# EAGLE design DigitalClockSegment (EAGLE 9.6.1)
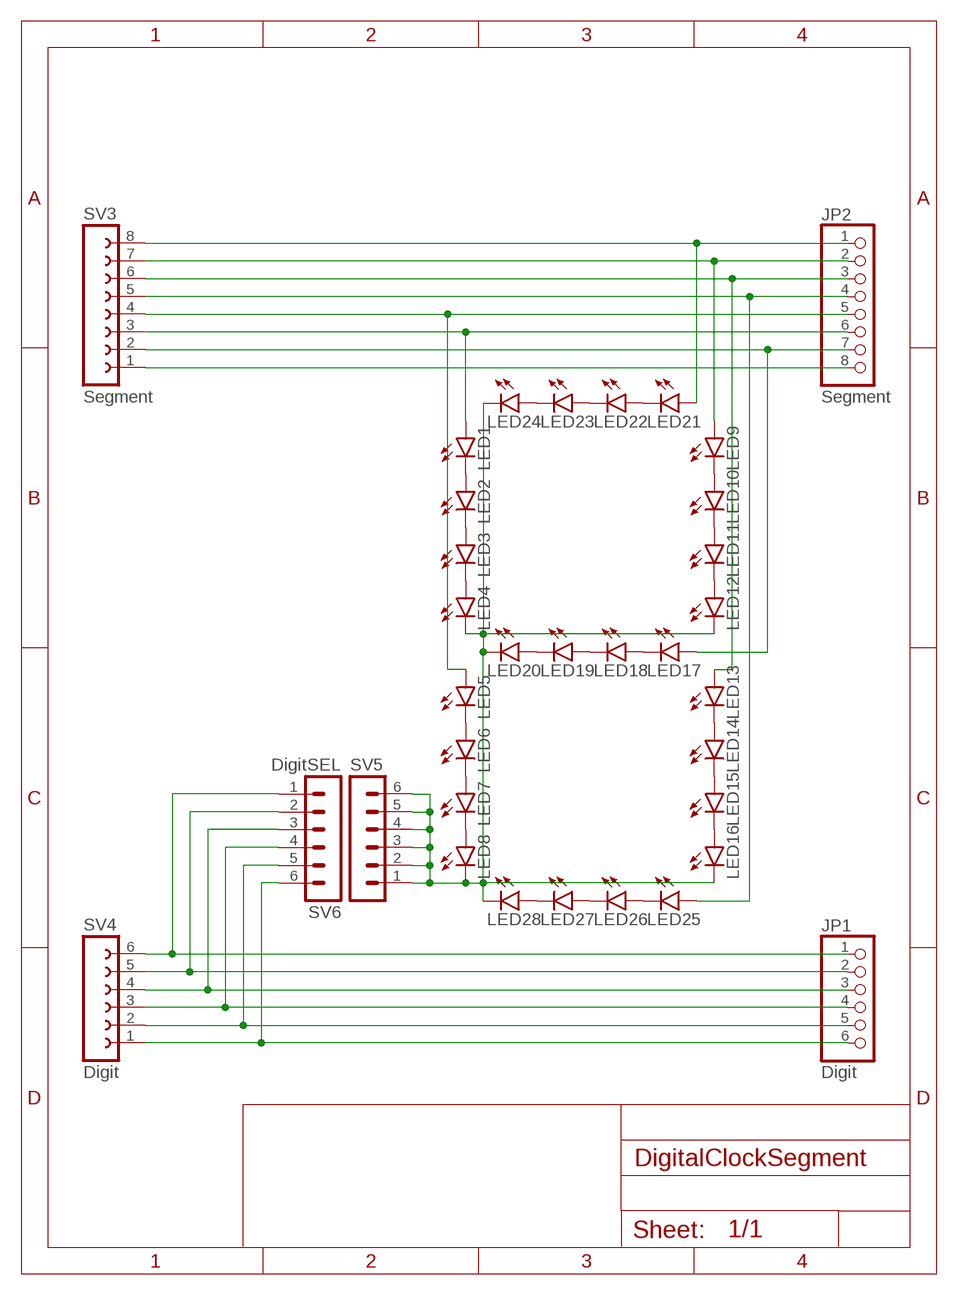
[diagram p0: schematic, sheet 1]

## Parts
JP1  Digit  PINHD-1X6/90  [1X06/90]
JP2  Segment  PINHD-1X8/90  [1X08/90]
LED1  LED5MM  [LED5MM]
LED2  LED5MM  [LED5MM]
LED3  LED5MM  [LED5MM]
LED4  LED5MM  [LED5MM]
LED5  LED5MM  [LED5MM]
LED6  LED5MM  [LED5MM]
LED7  LED5MM  [LED5MM]
LED8  LED5MM  [LED5MM]
LED9  LED5MM  [LED5MM]
LED10  LED5MM  [LED5MM]
LED11  LED5MM  [LED5MM]
LED12  LED5MM  [LED5MM]
LED13  LED5MM  [LED5MM]
LED14  LED5MM  [LED5MM]
LED15  LED5MM  [LED5MM]
LED16  LED5MM  [LED5MM]
LED17  LED5MM  [LED5MM]
LED18  LED5MM  [LED5MM]
LED19  LED5MM  [LED5MM]
LED20  LED5MM  [LED5MM]
LED21  LED5MM  [LED5MM]
LED22  LED5MM  [LED5MM]
LED23  LED5MM  [LED5MM]
LED24  LED5MM  [LED5MM]
LED25  LED5MM  [LED5MM]
LED26  LED5MM  [LED5MM]
LED27  LED5MM  [LED5MM]
LED28  LED5MM  [LED5MM]
SV3  Segment  FE08W  [FE08W]
SV4  Digit  FE06W  [FE06W]
SV5  MA06-1  [MA06-1]
SV6  DigitSEL  MA06-1  [MA06-1]

## Nets
N$1: LED1.K(C) LED2.A
N$2: LED2.K(C) LED3.A
N$3: LED3.K(C) LED4.A
N$4: LED5.K(C) LED6.A
N$5: LED6.K(C) LED7.A
N$6: LED7.K(C) LED8.A
N$7: LED9.K(C) LED10.A
N$8: LED10.K(C) LED11.A
N$9: LED11.K(C) LED12.A
N$10: LED13.K(C) LED14.A
N$11: LED14.K(C) LED15.A
N$12: LED15.K(C) LED16.A
N$13: LED17.K(C) LED18.A
N$14: LED18.K(C) LED19.A
N$15: LED19.K(C) LED20.A
N$16: LED21.K(C) LED22.A
N$17: LED22.K(C) LED23.A
N$18: LED23.K(C) LED24.A
N$19: LED25.K(C) LED26.A
N$20: LED26.K(C) LED27.A
N$21: LED27.K(C) LED28.A
N$22: JP2.7 LED17.A SV3.2
N$23: JP1.1 SV4.6 SV6.1
N$24: JP1.2 SV4.5 SV6.2
N$26: JP1.3 SV4.4 SV6.3
N$27: JP1.4 SV4.3 SV6.4
N$28: JP1.5 SV4.2 SV6.5
N$29: JP1.6 SV4.1 SV6.6
N$30: JP2.1 LED21.A SV3.8
N$31: JP2.2 LED9.A SV3.7
N$32: JP2.3 LED13.A SV3.6
N$33: JP2.4 LED25.A SV3.5
N$34: JP2.5 LED5.A SV3.4
N$35: JP2.6 LED1.A SV3.3
N$36: LED4.K(C) LED8.K(C) LED12.K(C) LED16.K(C) LED20.K(C) LED24.K(C) LED28.K(C) SV5.1 SV5.2 SV5.3 SV5.4 SV5.5 SV5.6
N$38: JP2.8 SV3.1

## Library data of the parts
JP1 = pinhead:PINHD-1X6: PIN HEADER
JP2 = pinhead:PINHD-1X8: PIN HEADER
LED1-LED28 = led:LED: LED OSRAM: - CHIPLED LG R971, LG N971, LY N971, LG Q971, LY Q971, LO R971, LY R971 LH N974, LH R974 LS Q976, LO Q976, LY Q976 LO Q996 - Hyper CHIPLED LW Q18S LB Q993, LB Q99A, LB R99A - SideLED LS A670, LO A670, LY A670, LG A670, LP A670 LB A673, LV A673, LT A673, LW A673 LH A674 LY A675 LS A676, LA A676, LO A676, LY A676, LW A676 LS A679, LY A679, LG A679 - Hyper Micro SIDELED® LS Y876, LA Y876, LO Y876, LY Y876 LT Y87S - SmartLED LW L88C, LW L88S LB L89C, LB L89S, LG L890 LS L89K, LO L89K, LY L89K LS L896, LA L896, LO L896, LY L896 - TOPLED LS T670, LO T670, LY T670, LG T670, LP T670 LSG T670, LSP T670, LSY T670, LOP T670, LYG T670 LG T671, LOG T671, LSG T671 LB T673, LV T673, LT T673, LW T673 LH T674 LS T676, LA T676, LO T676, LY T676, LB T676, LH T676, LSB T676, LW T676 LB T67C, LV T67C, LT T67C, LS T67K, LO T67K, LY T67K, LW E67C LS E67B, LA E67B, LO E67B, LY E67B, LB E67C, LV E67C, LT E67C LW T67C LS T679, LY T679, LG T679 LS T770, LO T770, LY T770, LG T770, LP T770 LB T773, LV T773, LT T773, LW T773 LH T774 LS E675, LA E675, LY E675, LS T675 LS T776, LA T776, LO T776, LY T776, LB T776 LHGB T686 LT T68C, LB T68C - Hyper Mini TOPLED® LB M676 - Mini TOPLED Santana® LG M470 LS M47K, LO M47K, LY M47K Source: http://www.osram.convergy.de LUXEON: - LUMILED® LXK2-PW12-R00, LXK2-PW12-S00, LXK2-PW14-U00, LXK2-PW14-V00 LXK2-PM12-R00, LXK2-PM12-S00, LXK2-PM14-U00 LXK2-PE12-Q00, LXK2-PE12-R00, LXK2-PE12-S00, LXK2-PE14-T00, LXK2-PE14-U00 LXK2-PB12-K00, LXK2-PB12-L00, LXK2-PB12-M00, LXK2-PB14-N00, LXK2-PB14-P00, LXK2-PB14-Q00 LXK2-PR12-L00, LXK2-PR12-M00, LXK2-PR14-Q00, LXK2-PR14-R00 LXK2-PD12-Q00, LXK2-PD12-R00, LXK2-PD12-S00 LXK2-PH12-R00, LXK2-PH12-S00 LXK2-PL12-P00, LXK2-PL12-Q00, LXK2-PL12-R00 Source: www.luxeon.com KINGBRIGHT: KA-3528ASYC Source: www.kingbright.com
SV3 = con-lsta:FE08W: FEMALE HEADER; OC_FARNELL: unknown; OC_NEWARK: unknown
SV4 = con-lsta:FE06W: FEMALE HEADER; OC_FARNELL: unknown; OC_NEWARK: unknown
SV5 SV6 = con-lstb:MA06-1: PIN HEADER; OC_FARNELL: unknown; OC_NEWARK: unknown

## Board
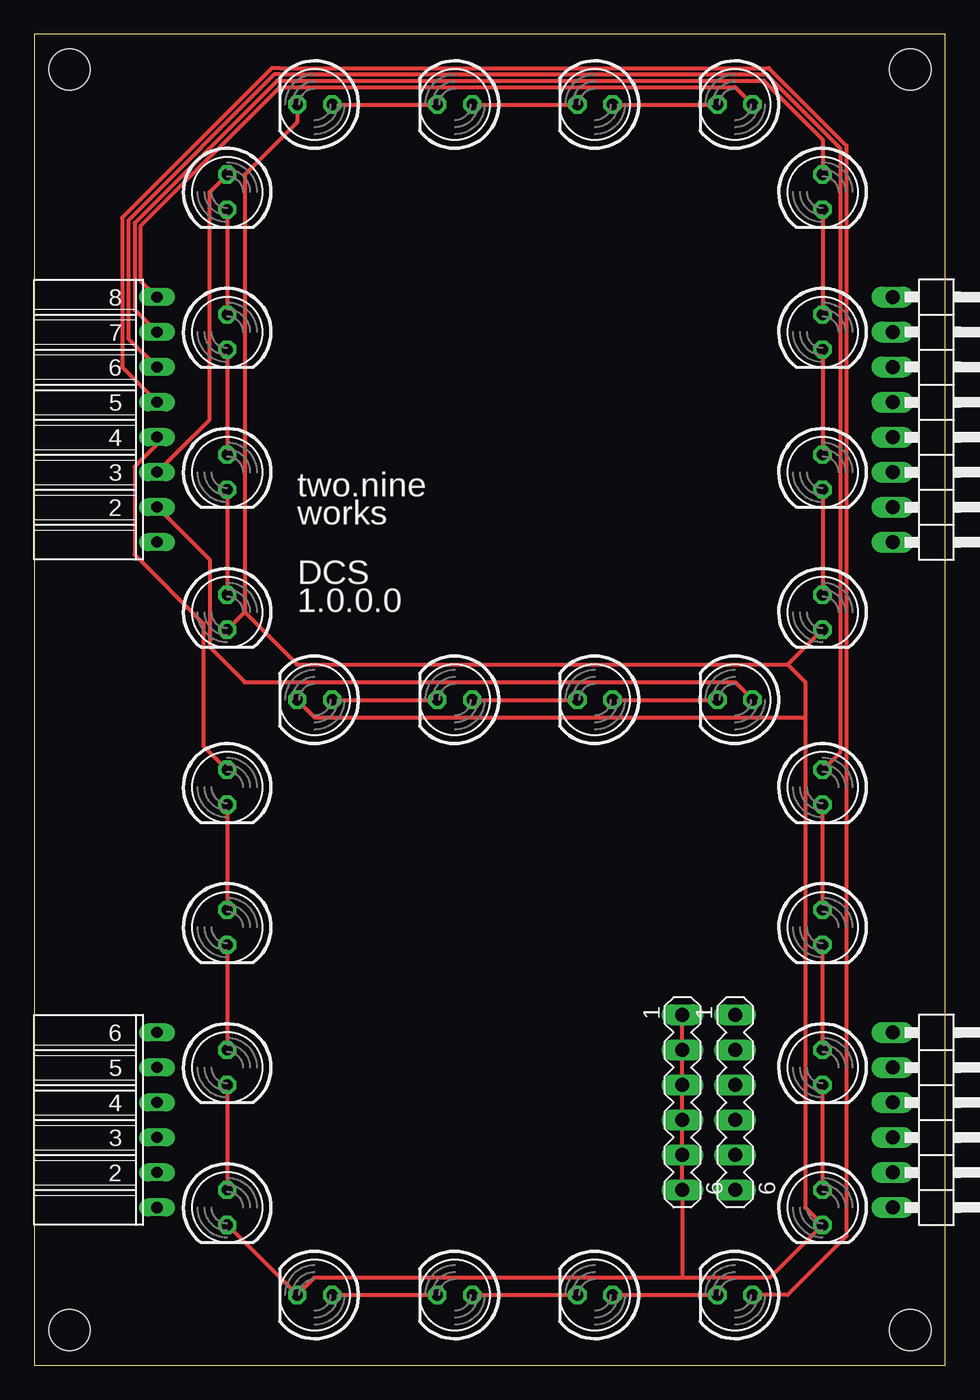
[diagram p1: board, top side]
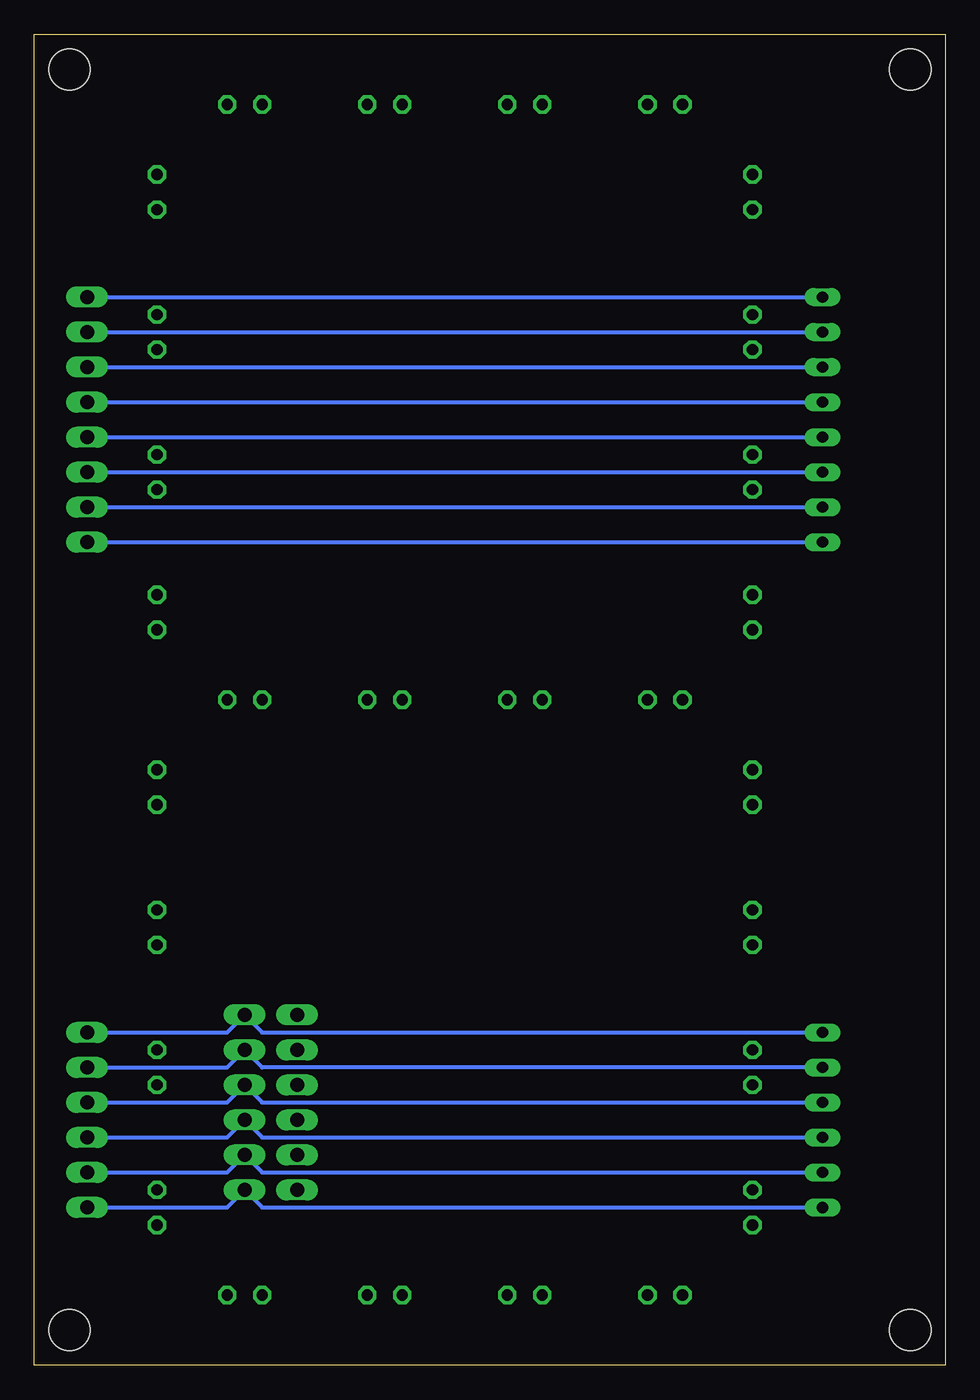
[diagram p2: board, bottom side, seen from below]

Size 66.04 x 96.52 mm. Coordinates in mm from the lower left corner, seen from the top.
Outline: 0,0 66.04,0 66.04,96.52 0,96.52 0,0
Copper layers (1*16): Top 0.035mm / dielectric 1.5mm / Bottom 0.035mm
Design rules "SeeedStudio_2layer_DRU_no_angle_20140221": minimum track width 6mil, minimum drill 12mil, track to track 6mil, track to pad 6mil, pad to pad 6mil, via to via 6mil, smd to smd 0mil, copper to edge 10mil, drill to drill 10mil, minimum pad ring 10mil, minimum via ring 6mil, stop-mask expansion 2mil, vias tented up to drill 100mil, thermal gap 10mil
Holes 3 mm at 2.54,93.98 63.5,93.98 63.5,2.54 2.54,2.54

### Footprints (pad centres in the part's own frame; a part is rotated, then mirrored left to right if it is on the bottom)
1X06/90 = drill 1.016 long: 1 -6.35,-3.81; 2 -3.81,-3.81; 3 -1.27,-3.81; 4 1.27,-3.81; 5 3.81,-3.81; 6 6.35,-3.81
1X08/90 = drill 1.016 long: 1 -8.89,-3.81; 2 -6.35,-3.81; 3 -3.81,-3.81; 4 -1.27,-3.81; 5 1.27,-3.81; 6 3.81,-3.81; 7 6.35,-3.81; 8 8.89,-3.81
LED5MM = drill 0.813 octagon: A -1.27,0; K 1.27,0
FE08W = drill 0.813 long: 1 -8.89,0; 2 -6.35,0; 3 -3.81,0; 4 -1.27,0; 5 1.27,0; 6 3.81,0; 7 6.35,0; 8 8.89,0
FE06W = drill 0.813 long: 1 -6.35,0; 2 -3.81,0; 3 -1.27,0; 4 1.27,0; 5 3.81,0; 6 6.35,0
MA06-1 = drill 1.016 long: 1 -6.35,0; 2 -3.81,0; 3 -1.27,0; 4 1.27,0; 5 3.81,0; 6 6.35,0

### Placement (x,y rotation side)
JP1  66.04,17.78 270 top
JP2  66.04,68.58 270 top
LED1  13.97,85.09 270 top
LED2  13.97,74.93 270 top
LED3  13.97,64.77 270 top
LED4  13.97,54.61 270 top
LED5  13.97,41.91 270 top
LED6  13.97,31.75 270 top
LED7  13.97,21.59 270 top
LED8  13.97,11.43 270 top
LED9  57.15,85.09 270 top
LED10  57.15,74.93 270 top
LED11  57.15,64.77 270 top
LED12  57.15,54.61 270 top
LED13  57.15,41.91 270 top
LED14  57.15,31.75 270 top
LED15  57.15,21.59 270 top
LED16  57.15,11.43 270 top
LED17  50.8,48.26 180 top
LED18  40.64,48.26 180 top
LED19  30.48,48.26 180 top
LED20  20.32,48.26 180 top
LED21  50.8,91.44 180 top
LED22  40.64,91.44 180 top
LED23  30.48,91.44 180 top
LED24  20.32,91.44 180 top
LED25  50.8,5.08 180 top
LED26  40.64,5.08 180 top
LED27  30.48,5.08 180 top
LED28  20.32,5.08 180 top
SV3  8.89,68.58 90 top
SV4  8.89,17.78 90 top
SV5  46.99,19.05 270 top
SV6  50.8,19.05 270 top

### Tracks (layer width: path | path; a pad name or v marks a point on that pad's centre or on a via)
N$1
  Top 0.305: LED1.K LED2.A
N$2
  Top 0.305: LED2.K LED3.A
N$3
  Top 0.305: LED3.K LED4.A
N$4
  Top 0.305: LED5.K LED6.A
N$5
  Top 0.305: LED6.K LED7.A
N$6
  Top 0.305: LED7.K LED8.A
N$7
  Top 0.305: LED9.K LED10.A
N$8
  Top 0.305: LED10.K LED11.A
N$9
  Top 0.305: LED11.K LED12.A
N$10
  Top 0.305: LED14.A LED13.K
N$11
  Top 0.305: LED15.A LED14.K
N$12
  Top 0.305: LED16.A LED15.K
N$13
  Top 0.305: LED18.A LED17.K
N$14
  Top 0.305: LED19.A LED18.K
N$15
  Top 0.305: LED20.A LED19.K
N$16
  Top 0.305: LED22.A LED21.K
N$17
  Top 0.305: LED23.A LED22.K
N$18
  Top 0.305: LED24.A LED23.K
N$19
  Top 0.305: LED26.A LED25.K
N$20
  Top 0.305: LED27.A LED26.K
N$21
  Top 0.305: LED28.A LED27.K
N$22
  Top 0.305: LED17.A 50.8,49.53 15.24,49.53 12.7,52.07 12.7,58.42 SV3.2
  Bottom 0.305: JP2.7 SV3.2
N$23
  Bottom 0.305: SV4.6 49.53,24.13 SV6.1 52.07,24.13 JP1.1
N$24
  Bottom 0.305: JP1.2 52.07,21.59 SV6.2 49.53,21.59 SV4.5
N$26
  Bottom 0.305: SV4.4 49.53,19.05 SV6.3 52.07,19.05 JP1.3
N$27
  Bottom 0.305: SV4.3 49.53,16.51 SV6.4 52.07,16.51 JP1.4
N$28
  Bottom 0.305: SV4.2 49.53,13.97 SV6.5 52.07,13.97 JP1.5
N$29
  Bottom 0.305: SV4.1 49.53,11.43 SV6.6 52.07,11.43 JP1.6
N$30
  Top 0.305: LED21.A 50.8,92.71 17.78,92.71 7.72,82.65 7.72,78.64 SV3.8
  Bottom 0.305: JP2.1 SV3.8
N$31
  Top 0.305: LED9.A 57.15,88.9 52.88,93.17 17.78,93.17 17.59,93.17 7.26,82.84 7.26,76.56 SV3.7
  Bottom 0.305: JP2.2 SV3.7
N$32
  Top 0.305: LED13.A 58.42,44.45 58.42,88.28 53.07,93.62 17.78,93.62 17.4,93.62 6.81,83.03 6.81,74.47 SV3.6
  Bottom 0.305: JP2.3 SV3.6
N$33
  Top 0.305: LED25.A 54.61,5.08 58.88,9.35 58.88,88.47 53.26,94.08 17.78,94.08 17.21,94.08 6.35,83.22 6.35,72.39 SV3.5
  Bottom 0.305: JP2.4 SV3.5
N$34
  Top 0.305: SV3.4 8.89,66.8 7.26,65.17 7.26,58.78 12.24,53.8 12.24,44.91 LED5.A
  Bottom 0.305: JP2.5 SV3.4
N$35
  Top 0.305: LED1.A 12.7,85.09 12.7,68.58 SV3.3
  Bottom 0.305: JP2.6 SV3.3
N$36
  Top 0.305: SV5.1 SV5.2 SV5.3 SV5.4 SV5.5 SV5.6 46.99,6.35 | LED24.K 19.05,90.17 15.24,86.36 15.24,54.61 | 15.24,54.61 19.05,50.8 54.61,50.8 | LED12.K 54.61,50.8 | 54.61,50.8 55.88,49.53 55.88,46.99 | 55.88,46.99 55.88,11.43 LED16.K 53.34,6.35 46.99,6.35 | LED4.K 15.24,54.61 | LED20.K 20.32,46.99 55.88,46.99 | LED8.K LED28.K 20.32,6.35 46.99,6.35
N$38
  Bottom 0.305: JP2.8 SV3.1

### Text on the board
tNames: two.nine / works | DCS / 1.0.0.0